# EAGLE design BLE Board (EAGLE 9.6.2)
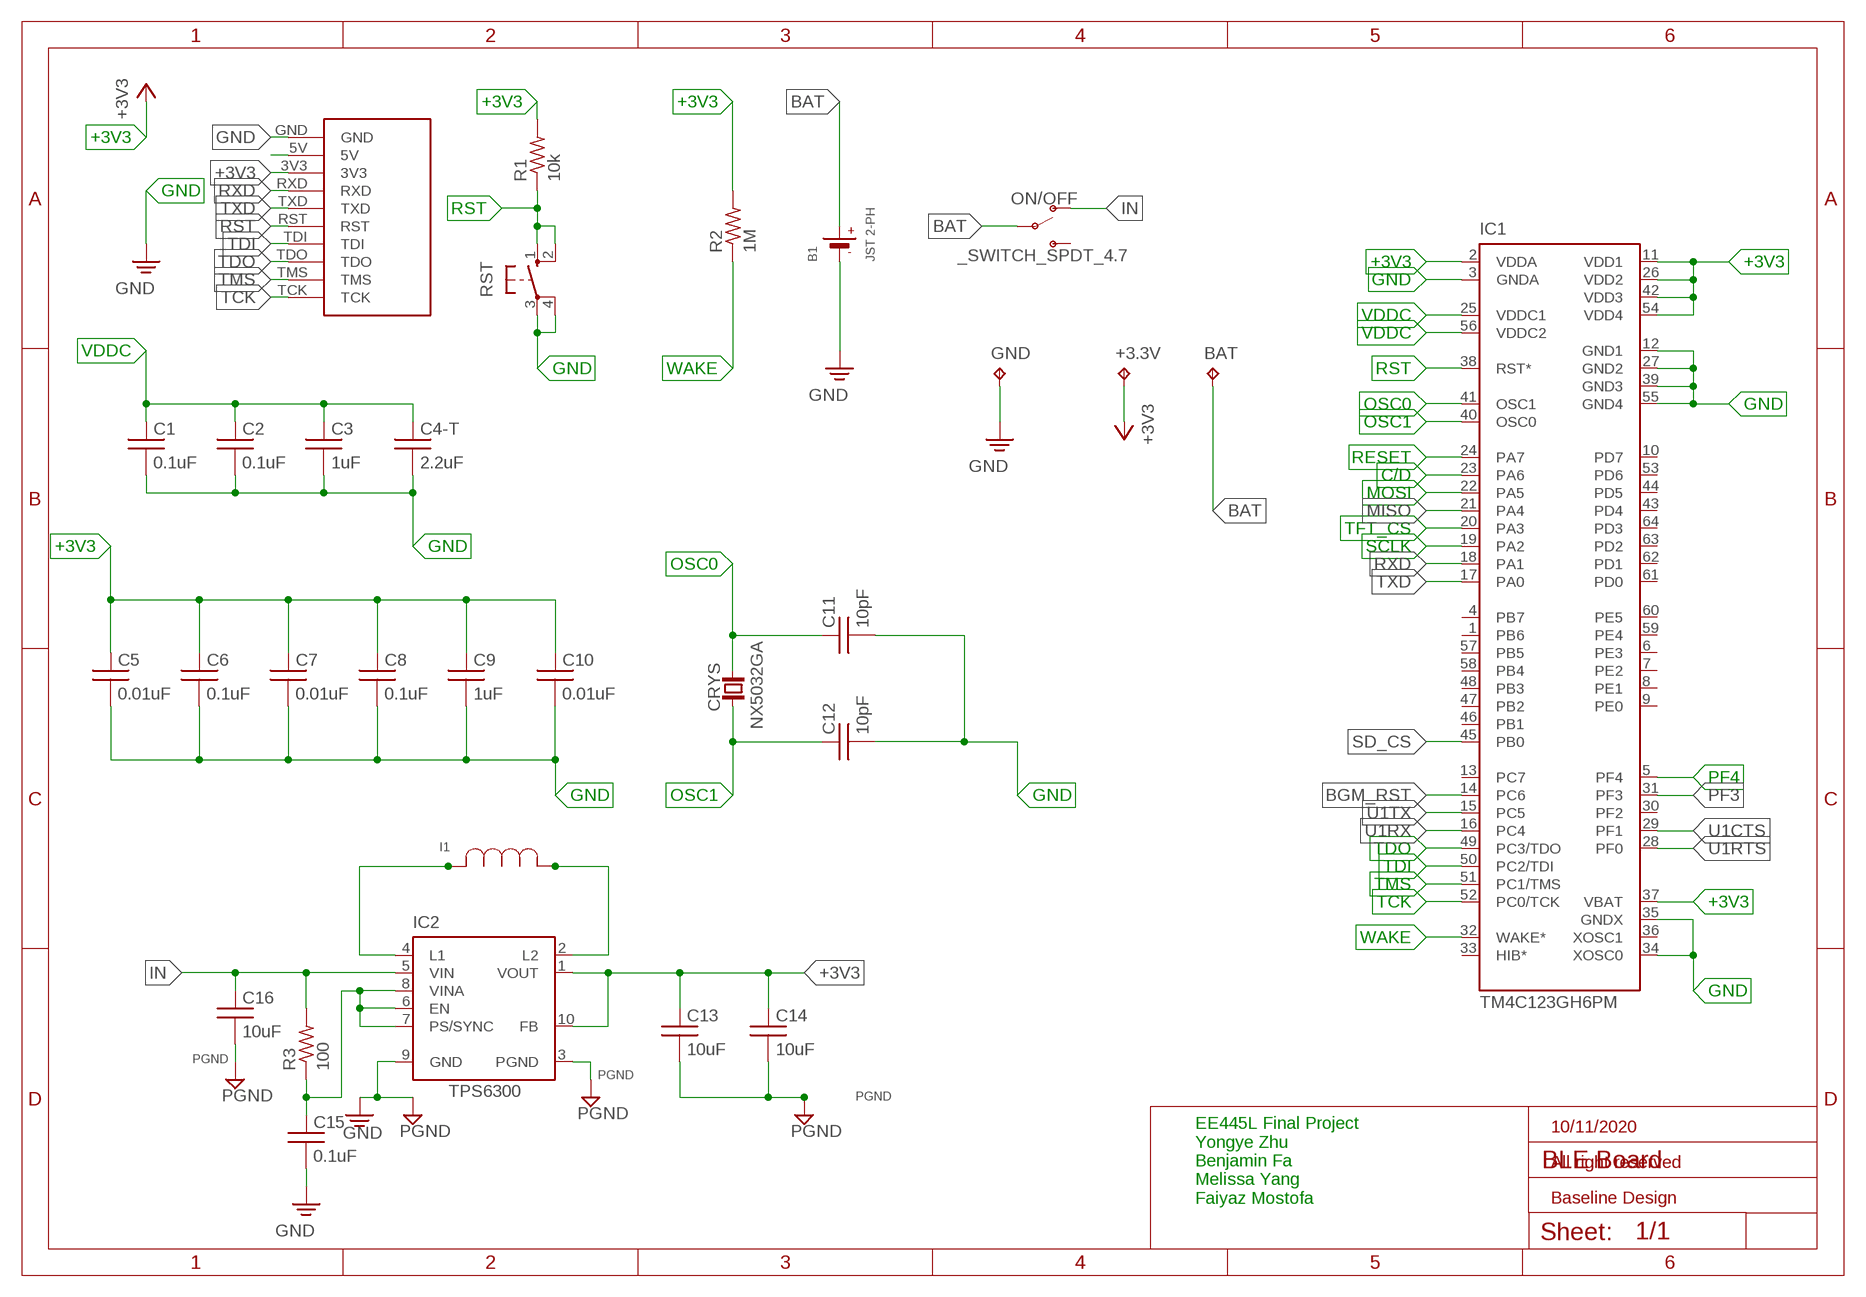
[diagram p0: schematic, sheet 1, part 1 of 2]
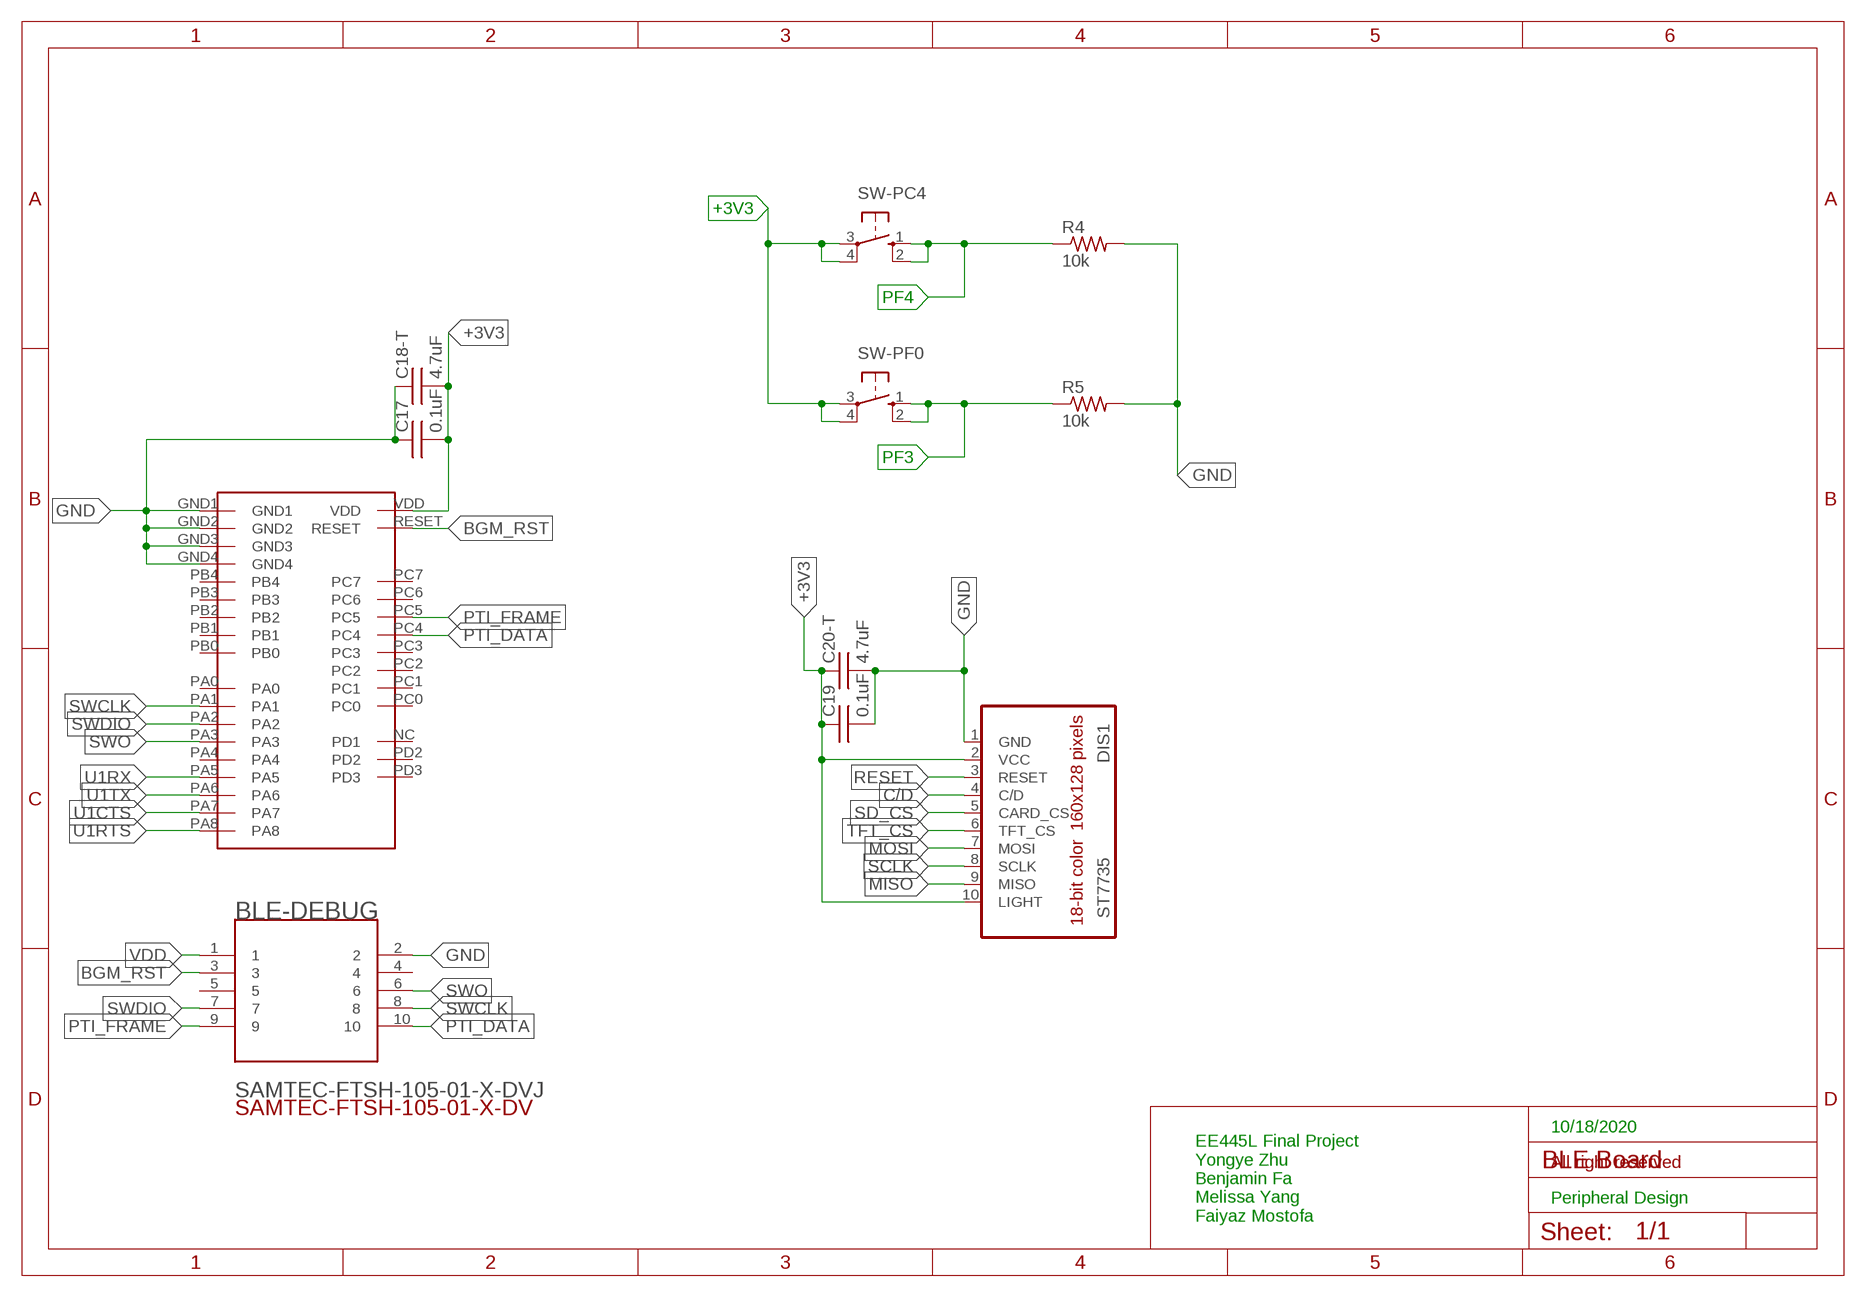
[diagram p1: schematic, sheet 1, part 2 of 2]

## Parts
+3.3V  TP_KEYSTONE500X  [P1.1MM]
B1  JST 2-PH  BATTERY  [JSTPH2]
BAT  TP_KEYSTONE500X  [P1.1MM]
BLE  BGM220P  [BGM220P]
BLE-DEBUG  SAMTEC-FTSH-105-01-X-DVJ  [SAMTEC-FTSH-105-01-X-DV]
C1  0.1uF  CAPACITORC0603K  [C0603K]
C2  0.1uF  CAPACITORC0603K  [C0603K]
C3  1uF  CAPACITORC0603K  [C0603K]
C4-T  2.2uF  CAPACITORC0603K  [C0603K]
C5  0.01uF  CAPACITORC0603K  [C0603K]
C6  0.1uF  CAPACITORC0603K  [C0603K]
C7  0.01uF  CAPACITORC0603K  [C0603K]
C8  0.1uF  CAPACITORC0603K  [C0603K]
C9  1uF  CAPACITORC0603K  [C0603K]
C10  0.01uF  CAPACITORC0603K  [C0603K]
C11  10pF  CAPACITORC0603K  [C0603K]
C12  10pF  CAPACITORC0603K  [C0603K]
C13  10uF  CAPACITORC0603K  [C0603K]
C14  10uF  CAPACITORC0603K  [C0603K]
C15  0.1uF  CAPACITORC0603K  [C0603K]
C16  10uF  CAPACITORC0603K  [C0603K]
C17  0.1uF  CAPACITORC0603K  [C0603K]
C18-T  4.7uF  CAPACITORC0603K  [C0603K]
C19  0.1uF  CAPACITORC0603K  [C0603K]
C20-T  4.7uF  CAPACITORC0603K  [C0603K]
CRYS  NX5032GA  [2-SMD-5X3]
DIS1  ST7735  [ST7735]
GND  TP_KEYSTONE500X  [P1.1MM]
I1  IND_TPS  [IND_LPS3015]
IC1  TM4C123GH6PM  [SQFP-S-10X10-64]
IC2  TPS6300  [DRC-S-PVSON-N10]
JTAG  JTAG_SERIAL  [JTAG_SERIAL_PTH]
ON/OFF  _SWITCH_SPDT_4.7  [_SWITCH_SPDT_4.7]
R1  10k  RESISTORR0603  [R0603]
R2  1M  RESISTORR0603  [R0603]
R3  100  RESISTORR0603  [R0603]
R4  10k  RESISTORR0603  [R0603]
R5  10k  RESISTORR0603  [R0603]
RST  B3F-1052  [B3F-10XX]
SW-PC4  B3F-1052  [B3F-10XX]
SW-PF0  B3F-1052  [B3F-10XX]

## Nets
+3V3: +3.3V.TP BLE.VDD C5.1 C6.1 C7.1 C8.1 C9.1 C10.1 C13.1 C14.1 C17.2 C18-T.2 C19.1 C20-T.1 DIS1.2(VCC) DIS1.10(LIGHT) IC1.2(VDDA) IC1.11(VDD1) IC1.26(VDD2) IC1.37(VBAT) IC1.42(VDD3) IC1.54(VDD4) IC2.1(VOUT) IC2.10(FB) JTAG.3V3 R1.2 R2.2 SW-PC4.3(P) SW-PC4.4(P1) SW-PF0.3(P) SW-PF0.4(P1)
BAT: B1.2(+) BAT.TP ON/OFF.P$2(P)
BGM_RST: BLE-DEBUG.3 BLE.RESET IC1.14(PC6)
C/D: DIS1.4(C/D) IC1.23(PA6)
GND: B1.1(-) BLE-DEBUG.2 BLE.GND1 BLE.GND2 BLE.GND3 BLE.GND4 C1.2 C2.2 C3.2 C4-T.2 C5.2 C6.2 C7.2 C8.2 C9.2 C10.2 C11.2 C12.2 C15.2 C17.1 C18-T.1 C19.2 C20-T.2 DIS1.1(GND) GND.TP IC1.3(GNDA) IC1.12(GND1) IC1.27(GND2) IC1.34(XOSC0) IC1.35(GNDX) IC1.39(GND3) IC1.55(GND4) IC2.9(GND) JTAG.GND R4.2 R5.2 RST.3(P) RST.4(P1) ; supply symbol labelled PGND
IN: C16.1 IC2.5(VIN) ON/OFF.P$1(O) R3.2
MISO: DIS1.9(MISO) IC1.21(PA4)
MOSI: DIS1.7(MOSI) IC1.22(PA5)
N$1: C15.1 IC2.6(EN) IC2.7(PS/SYNC) IC2.8(VINA) R3.1
N$3: I1.2 IC2.4(L1)
N$4: I1.1 IC2.2(L2)
N$5: JTAG.5V
OSC0: C11.1 CRYS.2 IC1.41(OSC1)
OSC1: C12.1 CRYS.1 IC1.40(OSC0)
PF3: IC1.31(PF3) R5.1 SW-PF0.1(S) SW-PF0.2(S1)
PF4: IC1.5(PF4) R4.1 SW-PC4.1(S) SW-PC4.2(S1)
PGND: C13.2 C14.2 C16.2 IC2.3(PGND)
PTI_DATA: BLE-DEBUG.10 BLE.PC4
PTI_FRAME: BLE-DEBUG.9 BLE.PC5
RESET: DIS1.3(RESET) IC1.24(PA7)
RST: IC1.38(RST*) JTAG.RST R1.1 RST.1(S) RST.2(S1)
RXD: IC1.18(PA1) JTAG.RXD
SCLK: DIS1.8(SCLK) IC1.19(PA2)
SD_CS: DIS1.5(CARD_CS) IC1.45(PB0)
SWCLK: BLE-DEBUG.8 BLE.PA1
SWDIO: BLE-DEBUG.7 BLE.PA2
SWO: BLE-DEBUG.6 BLE.PA3
TCK: IC1.52(PC0/TCK) JTAG.TCK
TDI: IC1.50(PC2/TDI) JTAG.TDI
TDO: IC1.49(PC3/TDO) JTAG.TDO
TFT_CS: DIS1.6(TFT_CS) IC1.20(PA3)
TMS: IC1.51(PC1/TMS) JTAG.TMS
TXD: IC1.17(PA0) JTAG.TXD
U1CTS: BLE.PA7 IC1.29(PF1)
U1RTS: BLE.PA8 IC1.28(PF0)
U1RX: BLE.PA5 IC1.16(PC4)
U1TX: BLE.PA6 IC1.15(PC5)
VDD: BLE-DEBUG.1
VDDC: C1.1 C2.1 C3.1 C4-T.1 IC1.25(VDDC1) IC1.56(VDDC2)
WAKE: IC1.32(WAKE*) R2.1
Unconnected: BLE-DEBUG.4 BLE-DEBUG.5 BLE.NC(PD1) BLE.PA0 BLE.PA4 BLE.PB0 BLE.PB1 BLE.PB2 BLE.PB3 BLE.PB4 BLE.PC0 BLE.PC1 BLE.PC2 BLE.PC3 BLE.PC6 BLE.PC7 BLE.PD2 BLE.PD3 IC1.1(PB6) IC1.4(PB7) IC1.6(PE3) IC1.7(PE2) IC1.8(PE1) IC1.9(PE0) IC1.10(PD7) IC1.13(PC7) IC1.30(PF2) IC1.33(HIB*) IC1.36(XOSC1) IC1.43(PD4) IC1.44(PD5) IC1.46(PB1) IC1.47(PB2) IC1.48(PB3) IC1.53(PD6) IC1.57(PB5) IC1.58(PB4) IC1.59(PE4) IC1.60(PE5) IC1.61(PD0) IC1.62(PD1) IC1.63(PD2) IC1.64(PD3) IC2.TH ON/OFF.P$3(S)

## Notes on the sheet
- 10/11/2020
- 10/18/2020
- All right reserved
- All right reserved
- EE445L Final Project
  Yongye Zhu
  Benjamin Fa
  Melissa Yang
  Faiyaz Mostofa
- Baseline Design
- Peripheral Design
- EE445L Final Project
  Yongye Zhu
  Benjamin Fa
  Melissa Yang
  Faiyaz Mostofa

## Library data of the parts
+3.3V BAT GND = EE445L:TP: Test pad Test point, black, Keystone Electronics 5001, Digikey 5001K-ND Test point, orange, Keystone Electronics 5003, Digikey 5003K-ND Test point, yellow, Keystone Electronics 5004, Digikey 5004K-ND Test point, white, Keystone Electronics 5002, Digikey 5002K-ND Test point, red, Keystone Electronics 5000, Digikey 5000K-ND
B1 = microbuilder:BATTERY: CR1220 SMT - Digikey: 3001K-ND CD2032 BAT-HLD-001 - Digikey: BAT-HLD-001-ND
BLE = zyongye:BGM220P
BLE-DEBUG = SAMTEC-FTSH-105-01-X-DV:SAMTEC-FTSH-105-01-X-DV: Check prices <https://pricing.snapeda.com/search/part/FTSH-105-01-L-DV-K/?ref=eda>; AVAILABILITY: Bad; DESCRIPTION: Connector Header Surface Mount 10 position 0.050 (1.27mm); MF: Samtec; MP: FTSH-105-01-L-DV-K; PACKAGE: TSSOP-20 Texas Instruments; PRICE: None; PURCHASE-URL: https://pricing.snapeda.com/search/part/FTSH-105-01-L-DV-K/?ref=eda
C1-C3 C4-T C5-C17 C18-T C19 C20-T = EE445L:CAPACITOR: CAPACITOR, American symbol
CRYS = NX5032GA:NX5032GA: CRYSTAL; AVAILABILITY: Unavailable; DESCRIPTION: 25MHz ±50ppm Crystal 8pF 70 Ohms 2-SMD, No Lead; MF: NDK America,; MP: NX5032GA; PACKAGE: SMD-2 NDK America,; PRICE: None
DIS1 = EE445L:ST7735: Sitronix ST7735R 18-bit color, 1.8" TFT LCD display, 128*160, http://www.adafruit.com/products/358 // Backlight (pin 10) connected to +3.3 V // MISO (pin 9) PA4 (SSI0Rx) // SCK (pin 8) connected to PA2 (SSI0Clk) // MOSI (pin 7) connected to PA5 (SSI0Tx) // TFT_CS (pin 6) connected to PA3 (SSI0Fss) // CARD_CS (pin 5) connected to PD7 GPIO output(for SDC) // Data/Command (pin 4) connected to PA6 (GPIO), high for data, low for command // RESET (pin 3) connected to PA7 (GPIO) // VCC (pin 2) connected to +3.3 V // Gnd (pin 1) connected to ground; OC_FARNELL: unknown; OC_NEWARK: unknown
I1 = 445L_final:IND_TPS: Inductor for the TPS buck-boost power converter
IC1 = EE445L:TM4C123: Tiva™ TM4C123GH6PM Microcontroller Texas Instrument's Tiva™ C Series microcontrollers provide designers a high-performance ARM® Cortex™-M-based architecture with a broad set of integration capabilities and a strong ecosystem of software and development tools. Targeting performance and flexibility, the Tiva™ C Series architecture offers a 80 MHz Cortex-M with FPU, a variety of integrated memories and multiple programmable GPIO. Tiva™ C Series devices offer consumers compelling cost-effective solutions by integrating application-specific peripherals and providing a comprehensive library of software tools which minimize board costs and design-cycle time. Offering quicker time-to-market and cost savings, the Tiva™ C Series microcontrollers are the leading choice in high-performance 32-bit applications.
IC2 = EE445L:TPS6300*: HIGH EFFICIENT SINGLE INDUCTOR BUCK-BOOST CONVERTER WITH 1.8-A SWITCHES Source: http://focus.ti.com/lit/ds/symlink/tps63001.pdf; MPN: TPS63000DRCTG4; OC_FARNELL: 1511852; OC_NEWARK: 59M7217
JTAG = Z:JTAG_SERIAL
ON/OFF = Z:_SWITCH_SPDT_4.7
R1-R5 = EE445L:RESISTOR: RESISTOR, American symbol
RST SW-PC4 SW-PF0 = EE445L:B3F-1052: OMRON SWITCH 1.1mm holes; MPN: B3F-1000; OC_FARNELL: 176432; OC_NEWARK: 36M3542

## Board
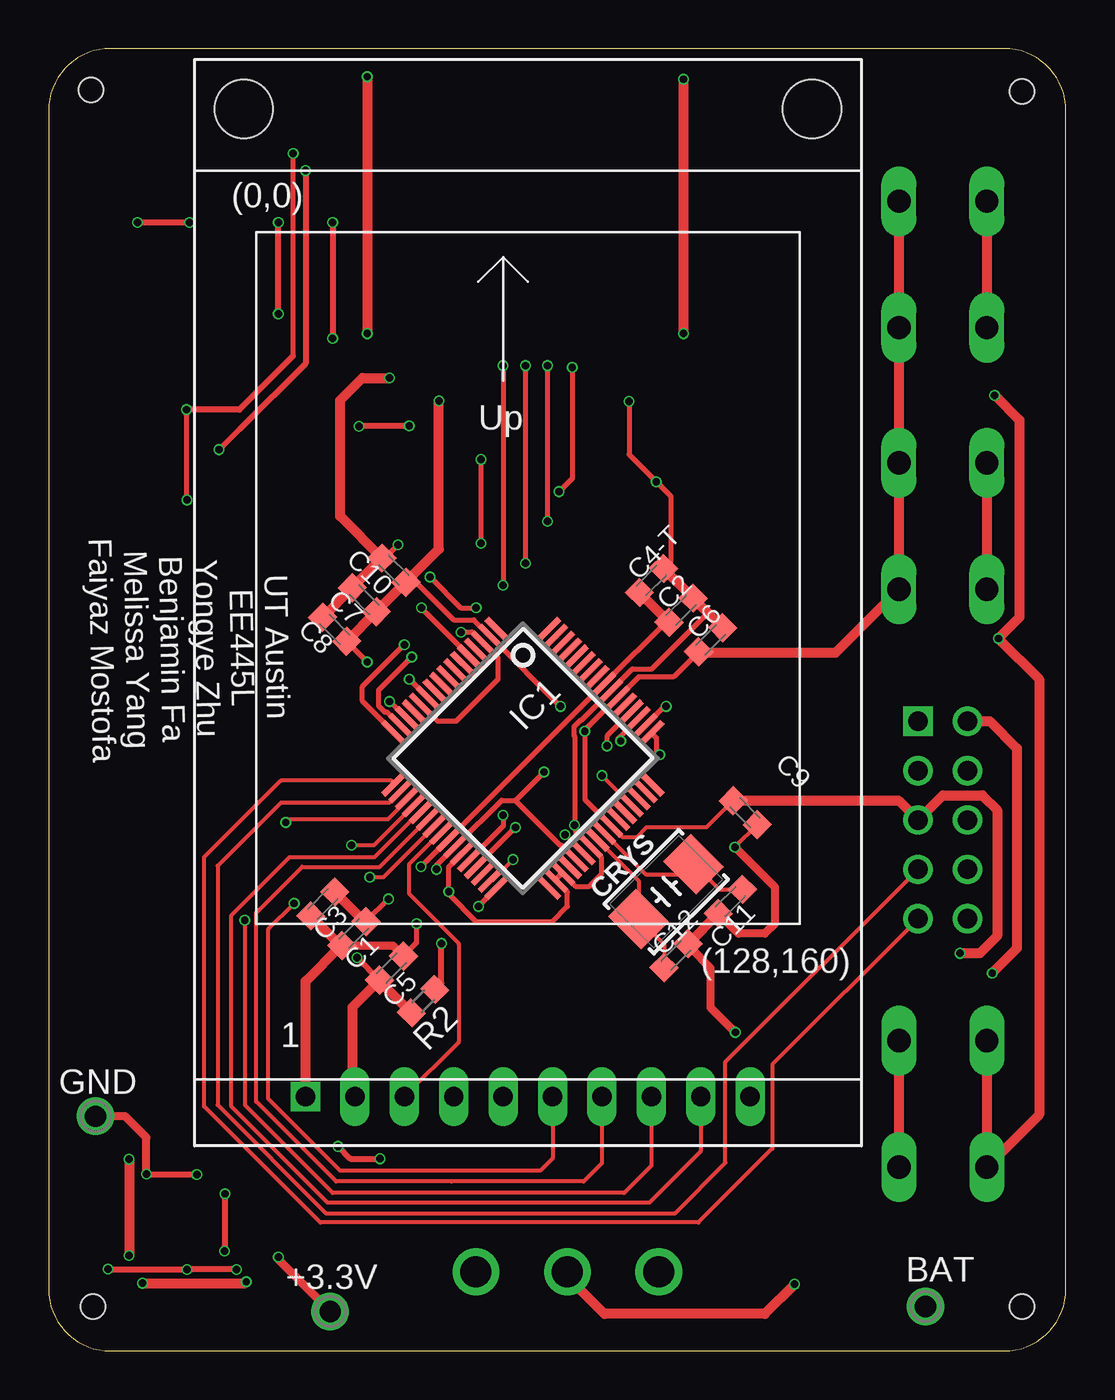
[diagram p2: board, top side]
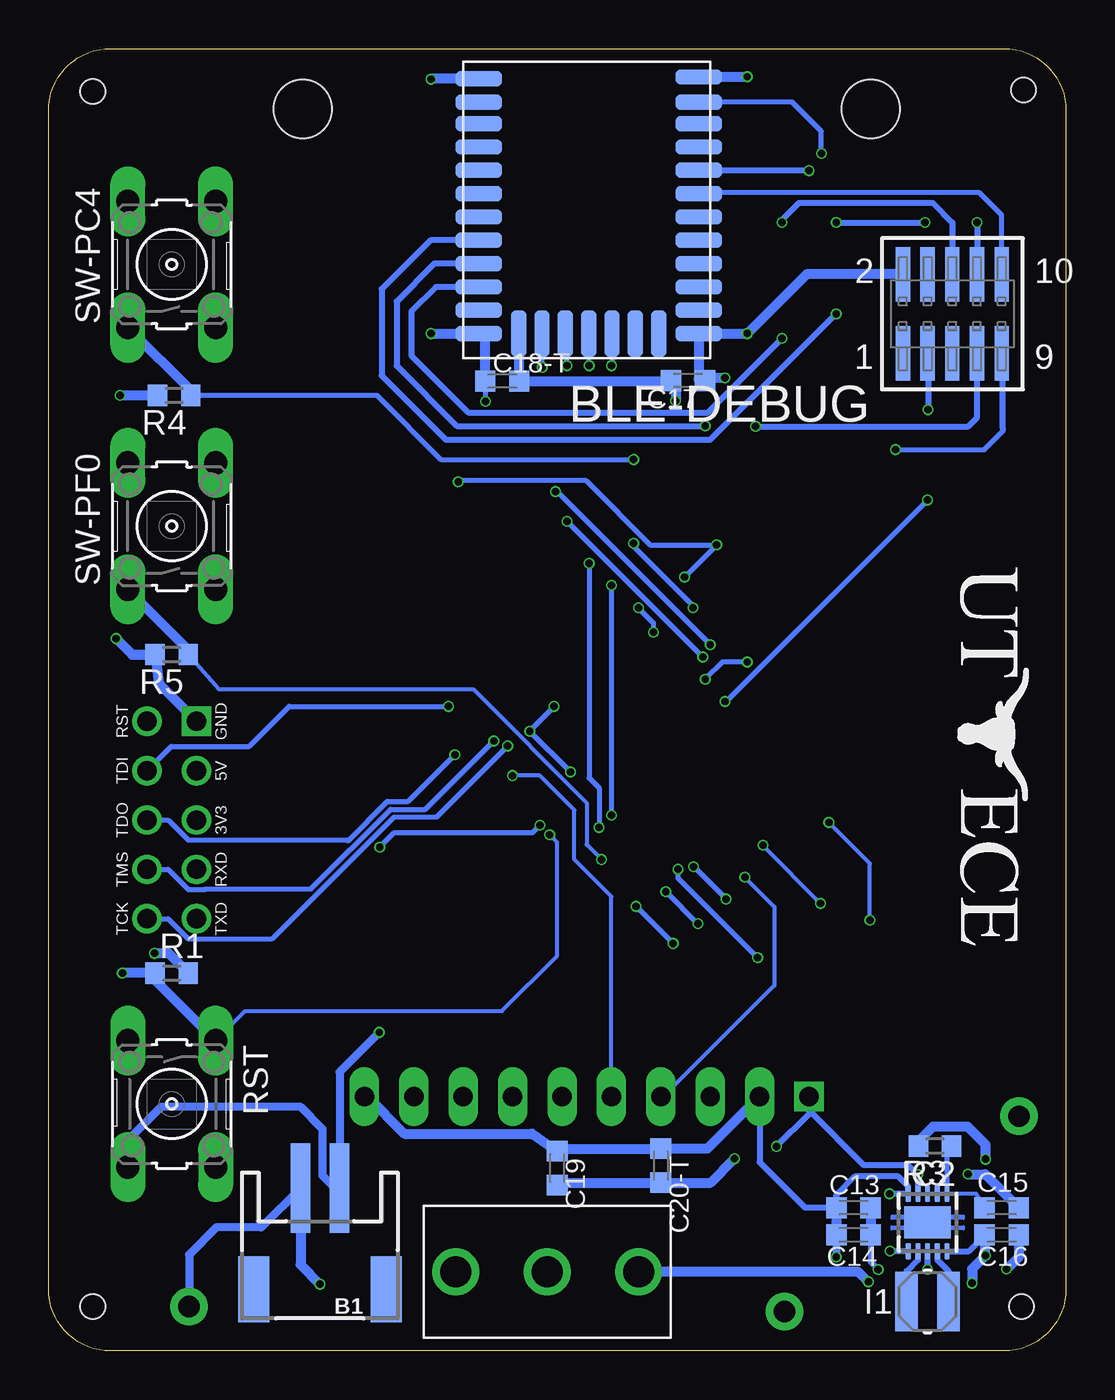
[diagram p3: board, bottom side, seen from below]

Size 52.3 x 66.98 mm. Coordinates in mm from the lower left corner, seen from the top.
Outline: 0,63.8 0,3.17 arc90 3.18,0 49.13,0 arc90 52.3,3.17 52.3,63.8 arc90 49.13,66.98 3.18,66.98 arc90 0,63.8
Copper layers (1*16): Top 0.035mm / dielectric 1.5mm / Bottom 0.035mm
Design rules "default *": minimum track width 8mil, minimum drill 15mil, track to track 6mil, track to pad 6mil, pad to pad 6mil, via to via 6mil, smd to smd 6mil, copper to edge 40mil, drill to drill 6mil, minimum pad ring 10mil, minimum via ring 1mil, stop-mask expansion 4mil, vias tented up to drill 0mil, thermal gap 10mil
Holes 1.27 mm at 2.18,64.85 50.04,64.77 2.29,2.29 50.04,2.29
tKeepout: area 21.5,59.8 to 27.7,65.7

### Footprints (pad centres in the part's own frame; a part is rotated, then mirrored left to right if it is on the bottom)
P1.1MM = drill 1.1 pad 1.93: TP 0,0
JSTPH2 = smd 1 x 4.6: 1 -1,-3.7; 2 1,-3.7 | smd 1.6 x 3.4: NC1 -3.4,1.5; NC2 3.4,1.5
BGM220P = smd 2.4 x 0.8: GND1 0.8,5.48; GND2 0.8,-7.62; GND3 12.1,-7.62; GND4 12.1,5.58; NC 12.1,-6.42; PA0 0.8,-1.62; PA1 0.8,-2.82; PA2 0.8,-4.02; PA3 0.8,-5.22; PA4 0.8,-6.42; PB0 0.8,-0.42; PB1 0.8,0.78; PB2 0.8,1.98; PB3 0.8,3.18; PB4 0.8,4.28; PC0 12.1,-5.22; PC1 12.1,-4.02; PC2 12.1,-2.82; PC3 12.1,-1.62; PC4 12.1,-0.42; PC5 12.1,0.78; PC6 12.1,1.98; PC7 12.1,3.18; RESET 12.1,4.28 | smd 0.8 x 2.4: PA5 4.05,-7.62; PA6 5.25,-7.62; PA7 6.45,-7.62; PA8 7.65,-7.62; PD2 10.05,-7.62; PD3 8.85,-7.62; VDD 2.85,-7.62
SAMTEC-FTSH-105-01-X-DV = smd 0.74 x 2.79: 1 -2.54,-2.032; 2 -2.54,2.032; 3 -1.27,-2.032; 4 -1.27,2.032; 5 0,-2.032; 6 0,2.032; 7 1.27,-2.032; 8 1.27,2.032; 9 2.54,-2.032; 10 2.54,2.032
C0603K = smd 1.05 x 1.08: 1 -0.875,0; 2 0.875,0
2-SMD-5X3 = smd 2 x 2.4: 1 -2,0; 2 2,0
ST7735 = drill 1 square: 1 -10.16,-30.48 | drill 1 long: 2 -7.62,-30.48; 3 -5.08,-30.48; 4 -2.54,-30.48; 5 0,-30.48; 6 2.54,-30.48; 7 5.08,-30.48; 8 7.62,-30.48; 9 10.16,-30.48; 10 12.7,-30.48 | hole 3: -13.335,20.32; 15.875,20.32
IND_LPS3015 = smd 1.143 x 3.048: 1 -1.079,0; 2 1.079,0
SQFP-S-10X10-64 = smd 0.3 x 1.6: 1 -3.75,-5.6; 2 -3.25,-5.6; 3 -2.75,-5.6; 4 -2.25,-5.6; 5 -1.75,-5.6; 6 -1.25,-5.6; 7 -0.75,-5.6; 8 -0.25,-5.6; 9 0.25,-5.6; 10 0.75,-5.6; 11 1.25,-5.6; 12 1.75,-5.6; 13 2.25,-5.6; 14 2.75,-5.6; 15 3.25,-5.6; 16 3.75,-5.6; 33 3.75,5.6; 34 3.25,5.6; 35 2.75,5.6; 36 2.25,5.6; 37 1.75,5.6; 38 1.25,5.6; 39 0.75,5.6; 40 0.25,5.6; 41 -0.25,5.6; 42 -0.75,5.6; 43 -1.25,5.6; 44 -1.75,5.6; 45 -2.25,5.6; 46 -2.75,5.6; 47 -3.25,5.6; 48 -3.75,5.6 | smd 1.6 x 0.3: 17 5.6,-3.75; 18 5.6,-3.25; 19 5.6,-2.75; 20 5.6,-2.25; 21 5.6,-1.75; 22 5.6,-1.25; 23 5.6,-0.75; 24 5.6,-0.25; 25 5.6,0.25; 26 5.6,0.75; 27 5.6,1.25; 28 5.6,1.75; 29 5.6,2.25; 30 5.6,2.75; 31 5.6,3.25; 32 5.6,3.75; 49 -5.6,3.75; 50 -5.6,3.25; 51 -5.6,2.75; 52 -5.6,2.25; 53 -5.6,1.75; 54 -5.6,1.25; 55 -5.6,0.75; 56 -5.6,0.25; 57 -5.6,-0.25; 58 -5.6,-0.75; 59 -5.6,-1.25; 60 -5.6,-1.75; 61 -5.6,-2.25; 62 -5.6,-2.75; 63 -5.6,-3.25; 64 -5.6,-3.75
DRC-S-PVSON-N10 = smd 0.28 x 0.85: 1 -1,-1.475; 2 -0.5,-1.475; 3 0,-1.475; 4 0.5,-1.475; 5 1,-1.475; 6 1,1.475; 7 0.5,1.475; 8 0,1.475; 9 -0.5,1.475; 10 -1,1.475 | smd 2.4 x 1.65: TH 0,0
JTAG_SERIAL_PTH = drill 1: 3V3 0,-1.27; 5V 2.54,-1.27; RST 5.08,1.27; RXD -2.54,-1.27; TCK -5.08,1.27; TDI 2.54,1.27; TDO 0,1.27; TMS -2.54,1.27; TXD -5.08,-1.27 | drill 1 square: GND 5.08,-1.27
_SWITCH_SPDT_4.7 = drill 1.6: P$1 -4.7,0; P$2 0,0; P$3 4.7,0
R0603 = smd 1 x 1.1: 1 -0.85,0; 2 0.85,0
B3F-10XX = drill 1.2 long: 1 -3.251,2.261; 2 3.251,2.261; 3 -3.251,-2.261; 4 3.251,-2.261

### Placement (x,y rotation side)
+3.3V  14.48,2.03 0 top
B1  38.35,4.67 180 bottom
BAT  45.09,2.29 0 top
BLE  30.99,59.94 0 bottom
BLE-DEBUG  5.84,53.34 0 bottom
C1  15.7,21.46 225 top
C2  32.51,38.1 45 top
C3  14.1,22.99 225 top
C4-T  30.99,39.62 45 top
C5  17.63,19.68 45 top
C6  34.04,36.58 45 top
C7  16.23,38.63 135 top
C8  14.71,37.11 135 top
C9  35.81,27.69 315 top
C10  17.75,40.16 135 top
C11  35.05,23.11 225 top
C12  32.26,20.32 45 top
C13  10.92,7.37 0 bottom
C14  10.92,5.97 0 bottom
C15  3.3,7.37 0 bottom
C16  3.3,5.97 0 bottom
C17  19.43,49.91 180 bottom
C18-T  28.98,49.89 0 bottom
C19  26.16,9.4 270 bottom
C20-T  20.83,9.53 270 bottom
CRYS  31.75,23.62 45 top
DIS1  23.37,43.56 0 top
GND  2.41,12.06 0 top
I1  7.11,2.54 0 bottom
IC1  24.38,30.48 225 top
IC2  7.11,6.6 0 bottom
JTAG  45.97,27.3 90 bottom
ON/OFF  26.67,4.06 180 bottom
R1  45.97,19.43 0 bottom
R2  19.25,17.98 225 top
R3  6.73,10.54 180 bottom
R4  45.85,49.15 180 bottom
R5  45.97,35.81 180 bottom
RST  45.97,12.7 270 bottom
SW-PC4  45.97,55.88 90 bottom
SW-PF0  45.97,42.42 90 bottom
U$1  [__LOGO_UT_ECE]  5.84,40.77 270 bottom

### Tracks (layer width: path | path; a pad name or v marks a point on that pad's centre or on a via)
+3V3  (via drill 0.38 pad 0.55)
  Top 0.203: IC1.42 29.04,26.88 29.51,26.42 30.23,26.42 30.73,26.92 33.81,26.92 C9.1
  Top 0.254: v19.94,24.77 19.94,24.97 IC1.26 23.29,28.32 23.98,28.32 | C6.1 32.13,34.67 30.34,34.67 29.65,33.98 | 29.65,33.98 IC1.54 | C8.1 v16.38,35.43 | v16.38,35.43 | v18.54,34.54 v18.55,34.54 IC1.11 | C10.1 18.69,39.73 20.83,37.59 21.87,37.59 IC1.2 v26.31,33.15 | 29.65,33.98 29.62,33.98 27.57,31.93 v27.57,31.87 27.57,28.36 29.04,26.88 | IC1.37 26.4,25.99 26.31,25.99 23.98,28.32 | 23.98,28.32 24.02,28.32 v25.47,29.77
  Top 0.305: v9.07,8.08 9.07,5.16 v9.04,5.13 | v15.85,20.22 v15.86,20.22 C5.1
  Top 0.406: v11.81,4.83 11.81,4.7 +3.3V.TP
  Top 0.508: v46.86,20.45 47.88,20.45 48.77,21.34 48.77,27.81 48.01,28.57 45.97,28.57 JTAG.3V3 43.7,28.3 C9.1 | SW-PC4.4 SW-PC4.3 SW-PF0.4 SW-PF0.3 40.44,35.9 33.87,35.9 C6.1 | DIS1.2 15.62,13.21 15.62,17.68 C5.1 17.01,19.02 R2.2 | v20.07,48.87 20.07,41.23 C10.1 C7.1 C8.1
  Bottom 0.254: v19.94,24.77 19.94,24.31 v15.85,20.22 | v16.38,35.43 17.65,35.43 v18.54,34.54 | v26.31,33.15 27.57,31.89 v27.57,31.87 v25.47,29.77
  Bottom 0.305: DIS1.2 15.75,9.7 13.41,7.37 C13.1 11.81,7.38 11.81,8 10.85,8.97 8.61,8.97 8.11,8.47 IC2.10 v9.07,8.08 | IC2.1 v9.04,5.13
  Bottom 0.406: C14.1 11.8,4.84 v11.81,4.83
  Bottom 0.508: v20.07,48.87 20.07,49.88 C17.2 20.33,49.89 C18-T.2 28.14,49.93 BLE.VDD | DIS1.10 35.92,13.08 34.01,11.17 27.44,11.17 C19.1 26.04,10.4 C20-T.1 18.43,10.4 DIS1.2 | C13.1 C14.1 | R1.2 46.14,20.45 v46.86,20.45
BAT  (via drill 0.38 pad 0.55)
  Top 0.508: v38.35,3.43 36.83,1.91 28.57,1.91 26.67,3.81 ON/OFF.P$2
  Bottom 0.406: B1.2 41.38,6.35 43.69,6.35 45.09,4.95 BAT.TP
  Bottom 0.508: B1.2 39.35,4.43 v38.35,3.43
BGM_RST  (via drill 0.38 pad 0.55)
  Top 0.254: v7.09,48.41 7.09,43.79 v7.11,43.76 | v17.53,33.4 17.57,33.4 IC1.14 | 12.57,51.18 v12.57,61.59
  Top 0.305: 12.57,51.18 9.8,48.41 v7.09,48.41
  Bottom 0.254: v7.11,43.76 17.47,33.4 v17.53,33.4 | v12.57,61.59 12.57,62.72 14.08,64.22 BLE.RESET
  Bottom 0.305: BLE-DEBUG.3 7.09,51.28 v7.09,48.41
C/D  (via drill 0.38 pad 0.55)
  Top 0.203: IC1.23 17.21,24.36 v16.51,24.36
  Bottom 0.203: v16.51,24.36 14.99,22.84 14.99,18.8 20.7,13.08 DIS1.4
GND  (via drill 0.38 pad 0.55)
  Top 0.203: C9.2 v35.28,25.91
  Top 0.254: C5.2 18.25,20.33 18.92,21.01 v18.92,21.97 | IC1.27 20.57,24.9 v20.57,23.62 20.57,23.5 21.97,22.1 25.91,22.1 26.67,22.86 26.67,23.6 IC1.34 IC1.35 27.08,23.89 27.8,23.89 28.43,24.53 28.43,25.37 IC1.39 27.1,26.71 27.1,26.77 27.04,26.83 v27.04,27.04 27.04,31.61 27.01,31.64 27.01,32.1 27.34,32.42 27.39,32.42 IC1.55 28.87,33.94 30.02,35.08 31.01,35.08 33.87,37.93 33.87,37.98 | v19.61,39.8 21.2,38.22 v21.98,38.22 | v21.21,36.96 21.42,36.96 21.44,36.98 21.77,36.98 IC1.3 23.11,35.64 23.11,34.54 20.96,32.38 20,32.38 IC1.12 | v17.96,41.45 17.28,40.78 C10.2 | C4-T.2 32,40.64 32,43.94 v31.24,44.7 29.84,46.1 v29.84,48.84
  Top 0.305: v5.03,9.09 7.59,9.09 v7.62,9.07 | v14.88,10.52 15.52,9.88 v17.04,9.88
  Top 0.406: C1.2 15.58,20.84 15.59,20.85 17.7,20.85 C5.2 | v5.03,9.09 5.03,10.97 3.94,12.06 GND.TP | v35.31,16.38 34.04,17.65 34.04,19.68 32.98,20.74 | v35.28,25.91 37.34,23.85 37.34,21.97 36.83,21.46 35.47,21.46 C11.2
  Top 0.508: RST.3 RST.4 50.93,12.14 50.93,34.54 v48.83,36.64 49.91,37.72 49.91,47.88 v48.64,49.15 | C4-T.2 C2.2 33.87,37.98 C6.2 | C8.2 C7.2 C10.2 14.99,42.93 14.99,48.9 16.13,50.04 v17.53,50.04 | v32.64,65.41 v32.64,52.32 | v16.38,65.53 v16.38,52.32 | DIS1.1 13.21,19.01 15.04,20.84 | 32.98,20.74 C12.2 C11.2 | 15.04,20.84 C1.2 | C3.2 15,20.84 15.04,20.84
  Bottom 0.254: v20.57,23.62 v18.92,21.97 | v27.04,27.04 27.42,26.66 34.53,26.66 v35.28,25.91 | C18-T.1 29.84,49.87 v29.84,48.84 | v21.98,38.22 21.21,37.44 v21.21,36.96 | v31.24,44.7 31.2,44.75 24.66,44.75 21.36,41.45 v17.96,41.45 v19.61,39.8
  Bottom 0.305: IC2.9 v7.62,9.07 8.1,9.55 10.39,9.55 13.21,12.37 DIS1.1 13.21,12.19 v14.88,10.52
  Bottom 0.406: v35.31,16.38 37.34,14.35 37.34,8.26 | 37.34,7.87 37.34,8.26 | RST.4 48.23,10.82 46.48,12.57 39.37,12.57 38.23,11.43 38.23,9.02 37.47,8.26 37.34,8.26
  Bottom 0.508: C19.2 26.04,8.65 C20-T.2 18.27,8.65 v17.04,9.88 | JTAG.GND 46.64,34.32 R5.2 48.01,35.81 v48.83,36.64 | v48.64,49.15 R4.2 | 18.89,49.97 BLE.GND3 v16.38,52.32 13.34,55.37 BLE-DEBUG.2 | 18.89,49.97 C17.1 | BLE.GND1 32.62,65.42 v32.64,65.41 | v32.64,52.32 BLE.GND2 29.86,51.99 C18-T.1 | BLE.GND4 v16.39,65.52 v16.38,65.53 | v17.53,50.04 18.82,50.04 18.89,49.97 | v5.03,9.09 4.15,9.09 C15.2 | B1.1 37.35,7.89 37.34,7.87
IN  (via drill 0.38 pad 0.55)
  Top 0.508: v4.14,9.86 v4.14,4.9 | v4.83,3.48 10.08,3.48 v10.16,3.56
  Bottom 0.305: IC2.5 5,5.13 C16.1 4.14,5.99
  Bottom 0.508: v4.14,9.86 4.14,10.62 5.05,11.53 6.84,11.53 7.38,10.99 R3.2 | 4.14,5.99 v4.14,4.9 4.83,4.22 v4.83,3.48 | C16.1 | v10.16,3.56 10.67,4.06 ON/OFF.P$1
MISO
  Top 0.203: IC1.21 19.12,27.76 16.76,25.4 12.39,25.4 9.4,22.4 9.4,12.57 14.35,7.62 30.89,7.62 33.53,10.27 DIS1.9
MOSI
  Top 0.203: DIS1.7 28.45,9.65 27.51,8.71 20.7,8.71 14.78,8.71 10.67,12.83 10.67,22.53 13.03,24.89 17.03,24.89 IC1.22
N$1
  Bottom 0.203: C15.1 4.62,8.08 IC2.6 IC2.7 IC2.8
  Bottom 0.254: IC2.6 6.11,10.51 R3.1
N$3
  Bottom 0.305: I1.2 6.03,4.09 6.61,4.67 IC2.4
N$4
  Bottom 0.305: IC2.2 7.61,4.67 8.19,4.09 I1.1
OSC0
  Top 0.203: CRYS.2 33.23,24.97 | 33.23,24.97 34.47,23.73 C11.1 | IC1.41 30.71,24.51 32.77,24.51 33.23,24.97
OSC1
  Top 0.203: IC1.40 30.34,24.18 CRYS.1 31.64,20.9 C12.1
PF3  (via drill 0.38 pad 0.55)
  Top 0.203: v23.88,25.27 22.82,24.22 IC1.31
  Top 0.508: SW-PF0.2 SW-PF0.1
  Bottom 0.203: R5.1 43.55,34.04 30.48,34.04 24.64,28.19 24.64,26.04 v23.88,25.27
  Bottom 0.508: R5.1 45.12,36.06 SW-PF0.1
PF4  (via drill 0.38 pad 0.55)
  Top 0.254: v22.23,45.85 v22.23,41.53 | IC1.5 21.66,35.7 19.18,38.19 v19.18,38.23
  Top 0.508: SW-PC4.2 SW-PC4.1
  Bottom 0.254: v22.23,45.85 32.13,45.85 35.43,49.15 44.96,49.15 R4.1 | v22.23,41.53 22.23,41.38 19.18,38.33 v19.18,38.23
  Bottom 0.508: SW-PC4.1 44.96,49.35 44.96,49.15
PGND  (via drill 0.38 pad 0.55)
  Top 0.305: v3.05,4.2 7.1,4.2 v7.11,4.19 v9.65,4.19
  Bottom 0.305: v7.11,4.19 IC2.3 | C14.2 10.05,4.59 v9.65,4.19
  Bottom 0.508: C13.2 C14.2 | C16.2 2.43,4.83 v3.05,4.2
PTI_DATA
  Bottom 0.254: BLE-DEBUG.10 3.3,58.42 4.45,59.56 18.85,59.56 BLE.PC4
PTI_FRAME  (via drill 0.38 pad 0.55)
  Top 0.254: 9.85,47.43 8.78,46.35 v8.76,46.35
  Top 0.305: v13.21,60.71 13.21,50.79 9.85,47.43
  Bottom 0.254: v8.76,46.35 4.19,46.35 3.24,47.31 3.24,47.43
  Bottom 0.305: BLE.PC5 13.23,60.72 v13.21,60.71 | 3.24,47.43 3.24,51.24 BLE-DEBUG.9
RESET
  Top 0.203: DIS1.3 21.08,15.88 21.08,20.95 18.54,23.5 18.54,25.06 20.18,26.7 IC1.24
RST  (via drill 0.38 pad 0.55)
  Top 0.203: v26.54,26.54 v26.55,26.54 IC1.38
  Top 0.508: RST.1 RST.2 | JTAG.RST 48.39,32.38 49.78,30.99 49.78,20.7 v48.51,19.43
  Bottom 0.203: RST.1 42.19,17.48 29.01,17.48 26.16,20.32 26.16,26.16 v26.54,26.54
  Bottom 0.508: v48.51,19.43 R1.1 46.82,19.06 RST.1
RXD
  Top 0.203: IC1.18 17.5,28.19 11.94,28.19 8.69,24.94 8.69,12.65 14.25,7.09 32.21,7.09 34.8,9.68 34.8,14.86 JTAG.RXD
SCLK  (via drill 0.38 pad 0.55)
  Top 0.203: IC1.19 18.48,28.39 17.45,27.36 12.37,27.36 v12.19,27.18 | DIS1.8 30.99,9.53 29.59,8.13 14.61,8.13 10.08,12.65 v10.08,22.15
  Bottom 0.203: v10.08,22.15 10.08,25.07 v12.19,27.18
SD_CS  (via drill 0.38 pad 0.55)
  Top 0.203: v28.45,29.59 IC1.45
  Bottom 0.203: DIS1.5 23.37,23.37 25.27,25.27 25.27,27.81 27.05,29.59 v28.45,29.59
SWCLK  (via drill 0.38 pad 0.55)
  Top 0.305: v11.81,53.34 v11.81,58.04 | v7.24,58.04 v4.57,58.04
  Bottom 0.305: BLE.PA1 32.66,57.12 35.18,54.61 35.18,50.16 31.88,46.86 18.29,46.86 v11.81,53.34 | v11.81,58.04 v7.24,58.04 | v4.57,58.04 BLE-DEBUG.8
SWDIO  (via drill 0.38 pad 0.55)
  Top 0.305: v18.54,47.57 15.98,47.57 v15.95,47.55
  Bottom 0.305: BLE.PA2 32.47,55.92 34.42,53.98 34.42,50.67 31.32,47.57 v18.54,47.57 | v15.95,47.55 5.03,47.55 4.57,48.01 BLE-DEBUG.7
SWO  (via drill 0.38 pad 0.55)
  Top 0.305: v14.61,58.04 v14.61,52.07
  Bottom 0.305: BLE.PA3 32.4,54.72 33.66,53.47 33.66,51.18 30.73,48.26 18.41,48.26 v14.61,52.07 | v14.61,58.04 14.61,58.17 13.72,59.05 6.86,59.05 5.84,58.04 BLE-DEBUG.6
TCK  (via drill 0.38 pad 0.55)
  Top 0.254: IC1.52 28.7,31.62 v28.7,31.11
  Bottom 0.254: JTAG.TCK 46.16,22.23 45.13,21.19 40.81,21.19 34.55,27.45 32.37,27.45 v28.7,31.11
TDI  (via drill 0.38 pad 0.55)
  Top 0.254: v31.75,33.15 31.65,33.15 IC1.50
  Bottom 0.254: v31.75,33.15 39.94,33.15 41.99,31.1 45.99,31.1 JTAG.TDI
TDO  (via drill 0.38 pad 0.55)
  Top 0.254: v31.42,30.66 31.25,30.83 31.25,31.53 IC1.49
  Bottom 0.254: JTAG.TDO 46.16,27.3 45.13,26.27 36.94,26.27 36.91,26.24 34.89,28.26 33.82,28.26 v31.42,30.66
TFT_CS  (via drill 0.38 pad 0.55)
  Top 0.203: DIS1.6 25.91,9.91 25.27,9.27 14.99,9.27 11.3,12.95 11.3,21.69 v12.62,23.01 | IC1.20 16.73,26.01 v15.57,26.01
  Bottom 0.203: v15.57,26.01 15.57,25.96 v12.62,23.01
TMS  (via drill 0.38 pad 0.55)
  Top 0.254: v29.42,31.37 29.27,31.51 30.26,32.49 IC1.51
  Bottom 0.254: JTAG.TMS 46.16,24.77 45.13,23.73 44.28,23.73 44.26,23.75 38.82,23.75 34.72,27.85 32.93,27.85 v29.42,31.37
TXD
  Top 0.203: JTAG.TXD 37.21,14.73 37.21,10.41 33.4,6.6 13.97,6.6 8,12.57 8,25.4 11.94,29.34 17.61,29.34 IC1.17
U1CTS  (via drill 0.38 pad 0.55)
  Top 0.254: v24.51,50.67 v24.51,40.51 | v24,26.92 IC1.29
  Bottom 0.254: BLE.PA7 24.54,50.7 v24.51,50.67 | v24.51,40.51 24.51,29.46 24,28.96 v24,26.92
U1RTS  (via drill 0.38 pad 0.55)
  Top 0.254: v23.37,50.67 v23.37,39.37 | v23.37,27.56 23.37,26.99 IC1.28
  Bottom 0.254: BLE.PA8 23.34,50.7 v23.37,50.67 | v23.37,39.37 v23.37,27.56
U1RX  (via drill 0.38 pad 0.55)
  Top 0.254: IC1.16 16.13,33.43 16.13,34.16 v18.29,36.32 | v26.24,44.2 26.92,44.88 v26.92,50.59
  Bottom 0.254: v18.29,36.32 26.16,44.2 v26.24,44.2 | v26.92,50.59 BLE.PA5
U1TX  (via drill 0.38 pad 0.55)
  Top 0.254: v18.67,35.69 16.97,33.99 16.97,33.17 17.3,32.85 17.42,32.85 IC1.15 | v25.65,42.67 v25.65,50.67
  Bottom 0.254: v18.67,35.69 v25.65,42.67 | v25.65,50.67 25.65,52.24 BLE.PA6
VDDC  (via drill 0.38 pad 0.55)
  Top 0.254: v17.48,23.24 C1.1 | C2.1 31.93,37.68 IC1.56 IC1.25 19.17,24.91 v19.14,24.91
  Top 0.508: C3.1 16.24,22.08 C1.1 | C4-T.1 C2.1
  Bottom 0.254: v19.14,24.91 v17.48,23.24
WAKE  (via drill 0.38 pad 0.55)
  Top 0.254: v22.1,22.86 23.08,23.84 IC1.32
  Top 0.305: R2.1 20.19,18.92 v20.19,20.95
  Bottom 0.254: v22.1,22.86 v20.19,20.95

### Text on the board
tPlace: UT Austin / EE445L / Yongye Zhu / Benjamin Fa / Melissa Yang / Faiyaz Mostofa